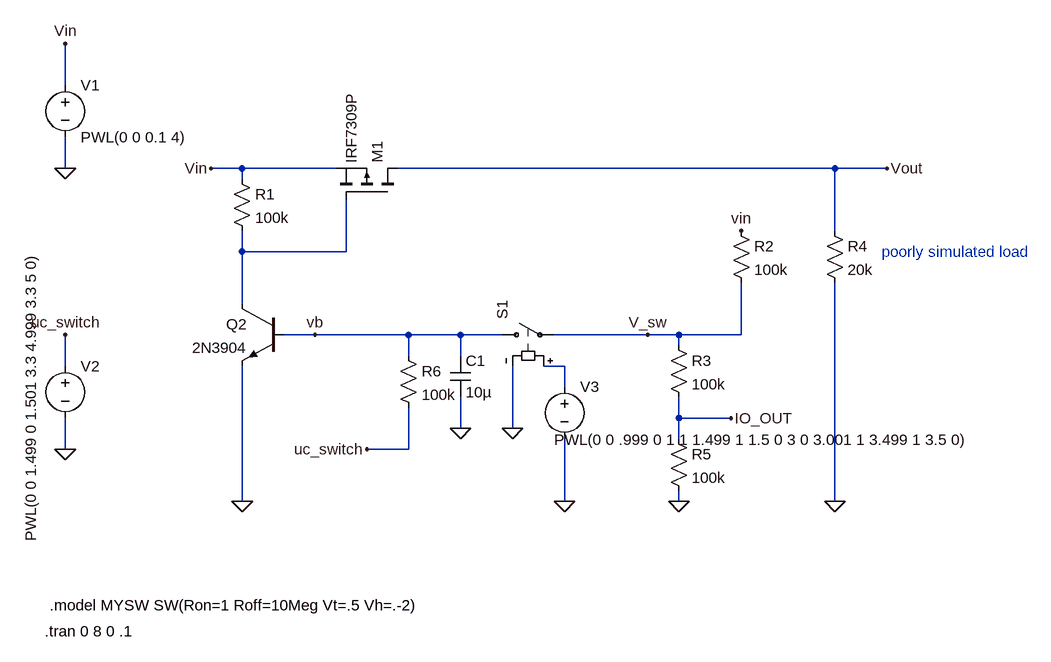
[diagram p0: schematic softpower_2.asc]
softpower_2.asc, the LTspice schematic file:
Version 4
SHEET 1 1092 1176
WIRE -448 -48 -448 -112
WIRE -448 80 -448 32
WIRE -176 80 -224 80
WIRE -32 80 -176 80
WIRE 736 80 64 80
WIRE 816 80 736 80
WIRE -176 96 -176 80
WIRE 736 176 736 80
WIRE -176 208 -176 176
WIRE -16 208 -16 128
WIRE -16 208 -176 208
WIRE -176 288 -176 208
WIRE -64 336 -112 336
WIRE 80 336 -64 336
WIRE 160 336 80 336
WIRE 224 336 160 336
WIRE 448 336 304 336
WIRE 496 336 448 336
WIRE 592 336 592 256
WIRE 592 336 496 336
WIRE 496 352 496 336
WIRE 80 368 80 336
WIRE 160 368 160 336
WIRE -448 384 -448 336
WIRE 320 384 288 384
WIRE 320 416 320 384
WIRE 496 464 496 432
WIRE 576 464 496 464
WIRE 160 480 160 432
WIRE 240 480 240 384
WIRE 496 496 496 464
WIRE -448 512 -448 464
WIRE 80 512 80 448
WIRE 80 512 16 512
WIRE -176 592 -176 384
WIRE 320 592 320 496
WIRE 496 592 496 576
WIRE 736 592 736 256
FLAG 736 592 0
FLAG -224 80 Vin
FLAG 816 80 Vout
FLAG -448 512 0
FLAG -448 80 0
FLAG -448 -112 Vin
FLAG -448 336 uc_switch
FLAG 320 592 0
FLAG 240 480 0
FLAG -176 592 0
FLAG 592 176 vin
FLAG 16 512 uc_switch
FLAG 160 480 0
FLAG -64 336 vb
FLAG 448 336 V_sw
FLAG 496 592 0
FLAG 576 464 IO_OUT
SYMBOL pmos 64 128 M270
SYMATTR InstName M1
SYMATTR Value IRF7309P
SYMBOL res 720 160 R0
SYMATTR InstName R4
SYMATTR Value 20k
SYMBOL sw 208 336 R270
SYMATTR InstName S1
SYMATTR Value ""
SYMATTR SpiceModel MYSW
SYMBOL voltage -448 -64 R0
WINDOW 123 0 0 Left 2
WINDOW 39 0 0 Left 2
SYMATTR InstName V1
SYMATTR Value PWL(0 0 0.1 4)
SYMBOL voltage -448 368 R0
WINDOW 123 0 0 Left 2
WINDOW 39 0 0 Left 2
WINDOW 3 -53 -161 VRight 2
SYMATTR Value PWL(0 0 1.499 0 1.501 3.3 4.999 3.3 5 0)
SYMATTR InstName V2
SYMBOL voltage 320 400 R0
WINDOW 123 0 0 Left 2
WINDOW 39 0 0 Left 2
WINDOW 3 626 97 Right 2
SYMATTR Value PWL(0 0 .999 0 1 1 1.499 1 1.5 0 3 0 3.001 1 3.499 1 3.5 0)
SYMATTR InstName V3
SYMBOL res -192 80 R0
SYMATTR InstName R1
SYMATTR Value 100k
SYMBOL res 576 160 R0
SYMATTR InstName R2
SYMATTR Value 100k
SYMBOL npn -112 288 M0
SYMATTR InstName Q2
SYMATTR Value 2N3904
SYMBOL res 64 352 R0
SYMATTR InstName R6
SYMATTR Value 100k
SYMBOL cap 144 368 R0
SYMATTR InstName C1
SYMATTR Value 10µ
SYMBOL res 480 336 R0
SYMATTR InstName R3
SYMATTR Value 100k
SYMBOL res 480 480 R0
SYMATTR InstName R5
SYMATTR Value 100k
TEXT 808 208 Left 2 ;poorly simulated load
TEXT -480 792 Left 2 !.tran 0 8 0 .1
TEXT -472 752 Left 2 !.model MYSW SW(Ron=1 Roff=10Meg Vt=.5 Vh=.-2)

The netlist it stands for:
* softpower_2.asc
M1 Vout N001 Vin Vin IRF7309P
R4 Vout 0 20k
S1 vb V_sw N002 0 MYSW
V1 Vin 0 PWL(0 0 0.1 4)
V2 uc_switch 0 PWL(0 0 1.499 0 1.501 3.3 4.999 3.3 5 0)
V3 N002 0 PWL(0 0 .999 0 1 1 1.499 1 1.5 0 3 0 3.001 1 3.499 1 3.5 0)
R1 Vin N001 100k
R2 Vin V_sw 100k
Q2 N001 vb 0 0 2N3904
R6 vb uc_switch 100k
C1 vb 0 10µ
R3 V_sw IO_OUT 100k
R5 IO_OUT 0 100k
.model NPN NPN
.model PNP PNP
.lib standard.bjt
.model NMOS NMOS
.model PMOS PMOS
.lib standard.mos
* poorly simulated load
.tran 0 8 0 .1
.model MYSW SW(Ron=1 Roff=10Meg Vt=.5 Vh=.-2)
.backanno
.end

* Results of the author's LTspice run, read from the files saved beside the schematic
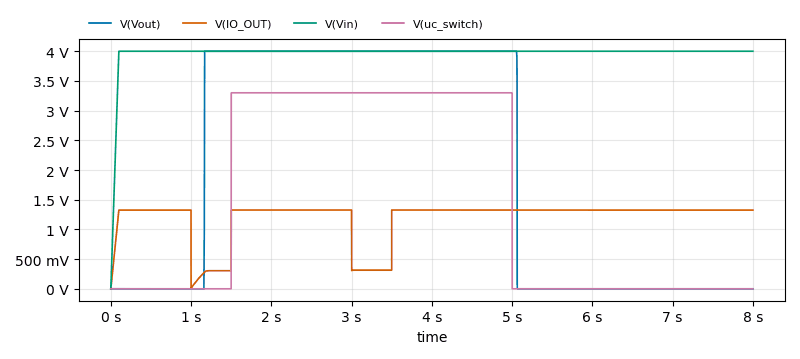
[diagram p1: Transient Analysis of softpower_2.asc, plotted from the saved traces]
* Transient Analysis, 1 run:
*   V(Vout): min -578.9 µV, max 4 V, average 1.948 V, rms 2.791 V, last -7.092 µV
*   V(IO_OUT): min 0 V, max 1.327 V, average 1.187 V, rms 1.239 V, last 1.325 V
*   V(Vin): min 0 V, max 4 V, average 3.975 V, rms 3.984 V, last 4 V
*   V(uc_switch): min 0 V, max 3.3 V, average 1.444 V, rms 2.182 V, last 0 V